# Altium schematic sheet esc.SchDoc
size A4
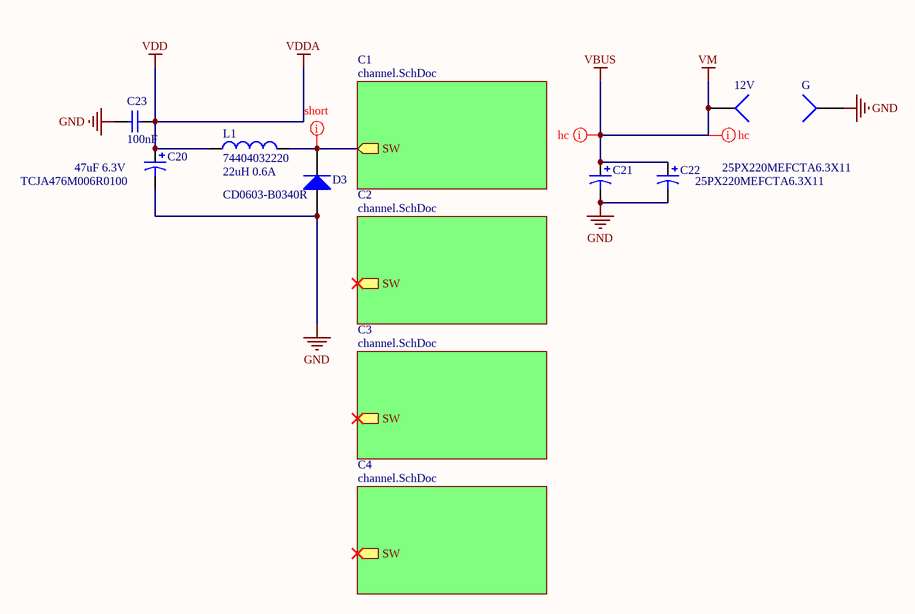
[diagram p0: esc.SchDoc]

## Parts
12V  12V  [large_pin]  (value not drawn)
C20  TCJA476M006R0100  value 47uF 6.3V  [my_1206_pol]
C21  25PX220MEFCTA6.3X11  [rad_2.5mm_0.7mm]
C22  25PX220MEFCTA6.3X11  [rad_2.5mm_0.7mm]
C23  100nF  [MY_0402]
D3  CD0603-B0340R  [my_0603]
G  G  [large_pin]  (value not drawn)
L1  74404032220  value 22uH 0.6A  [IND_3_3]

## Sub-sheets
C1 = channel.SchDoc: SW (out)
C2 = channel.SchDoc: SW (out)
C3 = channel.SchDoc: SW (out)
C4 = channel.SchDoc: SW (out)

## Nets
GND: C20.2 C21.2 C22.2 C23.1 D3.1(A) G.1
VBUS: 12V.1 C21.1 C22.1  [also labelled VM]
VDD: C20.1 C23.2 L1.1  [also labelled VDDA]
NetD3_2: D3.2(K) L1.2 ; sheet C1/SW

## Layout directives
net class hc: VBUS
net class short: NetD3_2

## Library data of the parts
12V G = Socket: LatestRevisionDate: 17-Jul-2002; LatestRevisionNote: Re-released for DXP Platform.; Publisher: Altium Limited
C20 = Cap Pol3: Polarized Capacitor (Surface Mount); Published: 8-Jun-2000; LatestRevisionDate: 29-May-2009; LatestRevisionNote: IPC-7351 Footprint Added.; PackageReference: C0805; Publisher: Altium Limited; PackageDescription: Chip Capacitor
C21 C22 = Cap Pol3: Polarized Capacitor (Surface Mount); Value: 10uF; Published: 8-Jun-2000; LatestRevisionDate: 29-May-2009; LatestRevisionNote: IPC-7351 Footprint Added.; PackageReference: C0805; Publisher: Altium Limited; PackageDescription: Chip Capacitor
C23 = Cap: Capacitor; Published: 8-Jun-2000; LatestRevisionDate: 17-Jul-2002; LatestRevisionNote: Re-released for DXP Platform.; PackageReference: RAD-0.3; Publisher: Altium Limited; PackageDescription: Radial Cap, Thru-Hole; 2 Leads; 0.3 in Pin Spacing; Value: 100nF
D3 = Diode: Default Diode; Published: 8-Jun-2000; LatestRevisionDate: 17-Jul-2002; LatestRevisionNote: Re-released for DXP Platform.; PackageVersion: Sep-1996; PackageReference: SMC; Publisher: Altium Limited; PackageDescription: DO-214-AB/SMC; 2 C-Bend Leads; Body 7.9 x 5.9 mm, inc. leads (LxW); Code_JEDEC: DO-214-AB
L1 = Inductor: Code_IEC: 1005; Published: 8-Jun-2000; LatestRevisionDate: 29-May-2009; LatestRevisionNote: IPC-7351 Footprint Added.; PackageReference: 0402-A; Publisher: Altium Limited; PackageDescription: Chip Inductor; Code_JEITA: 0402